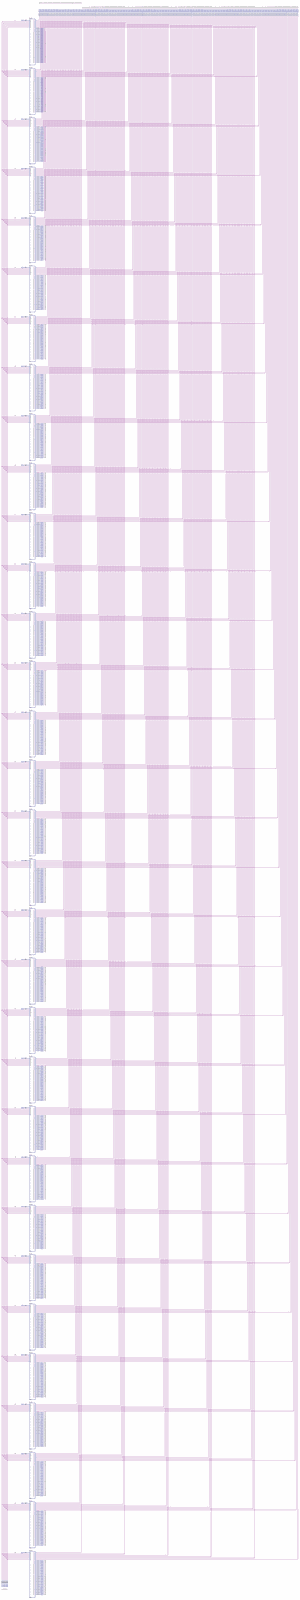
[diagram p0: schematic sheet, whole]
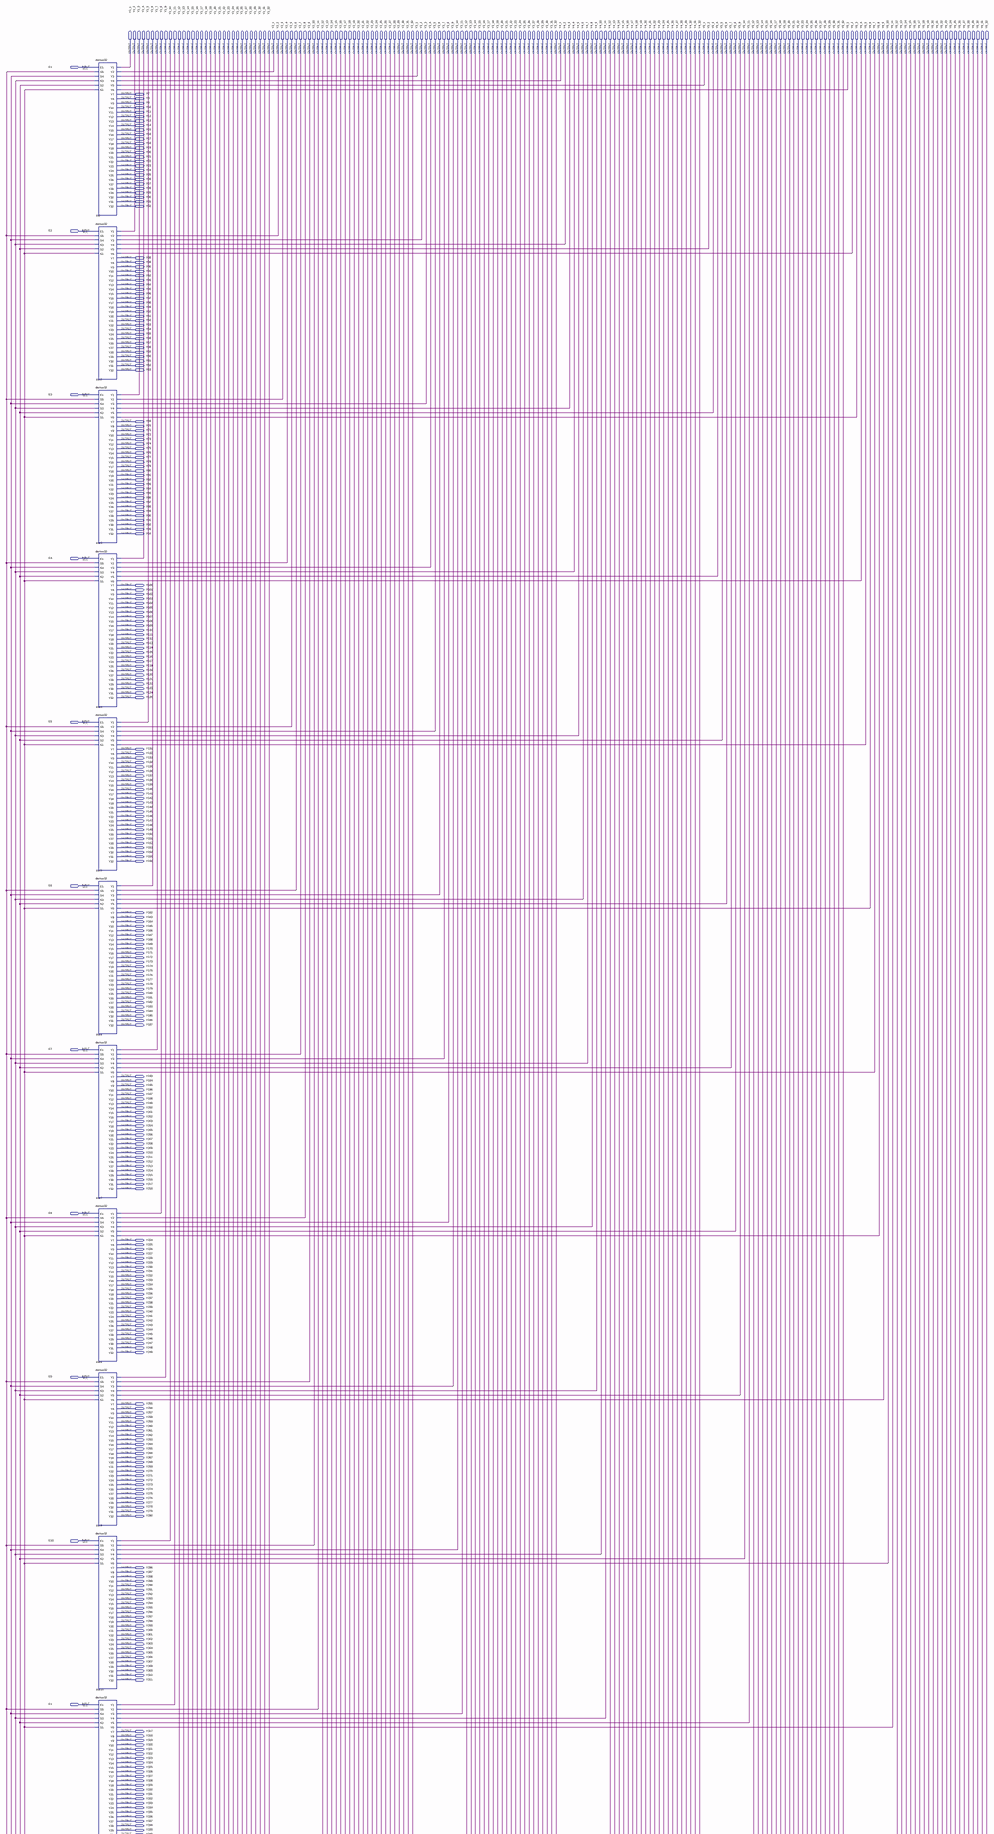
[diagram p1: schematic sheet, upper part]
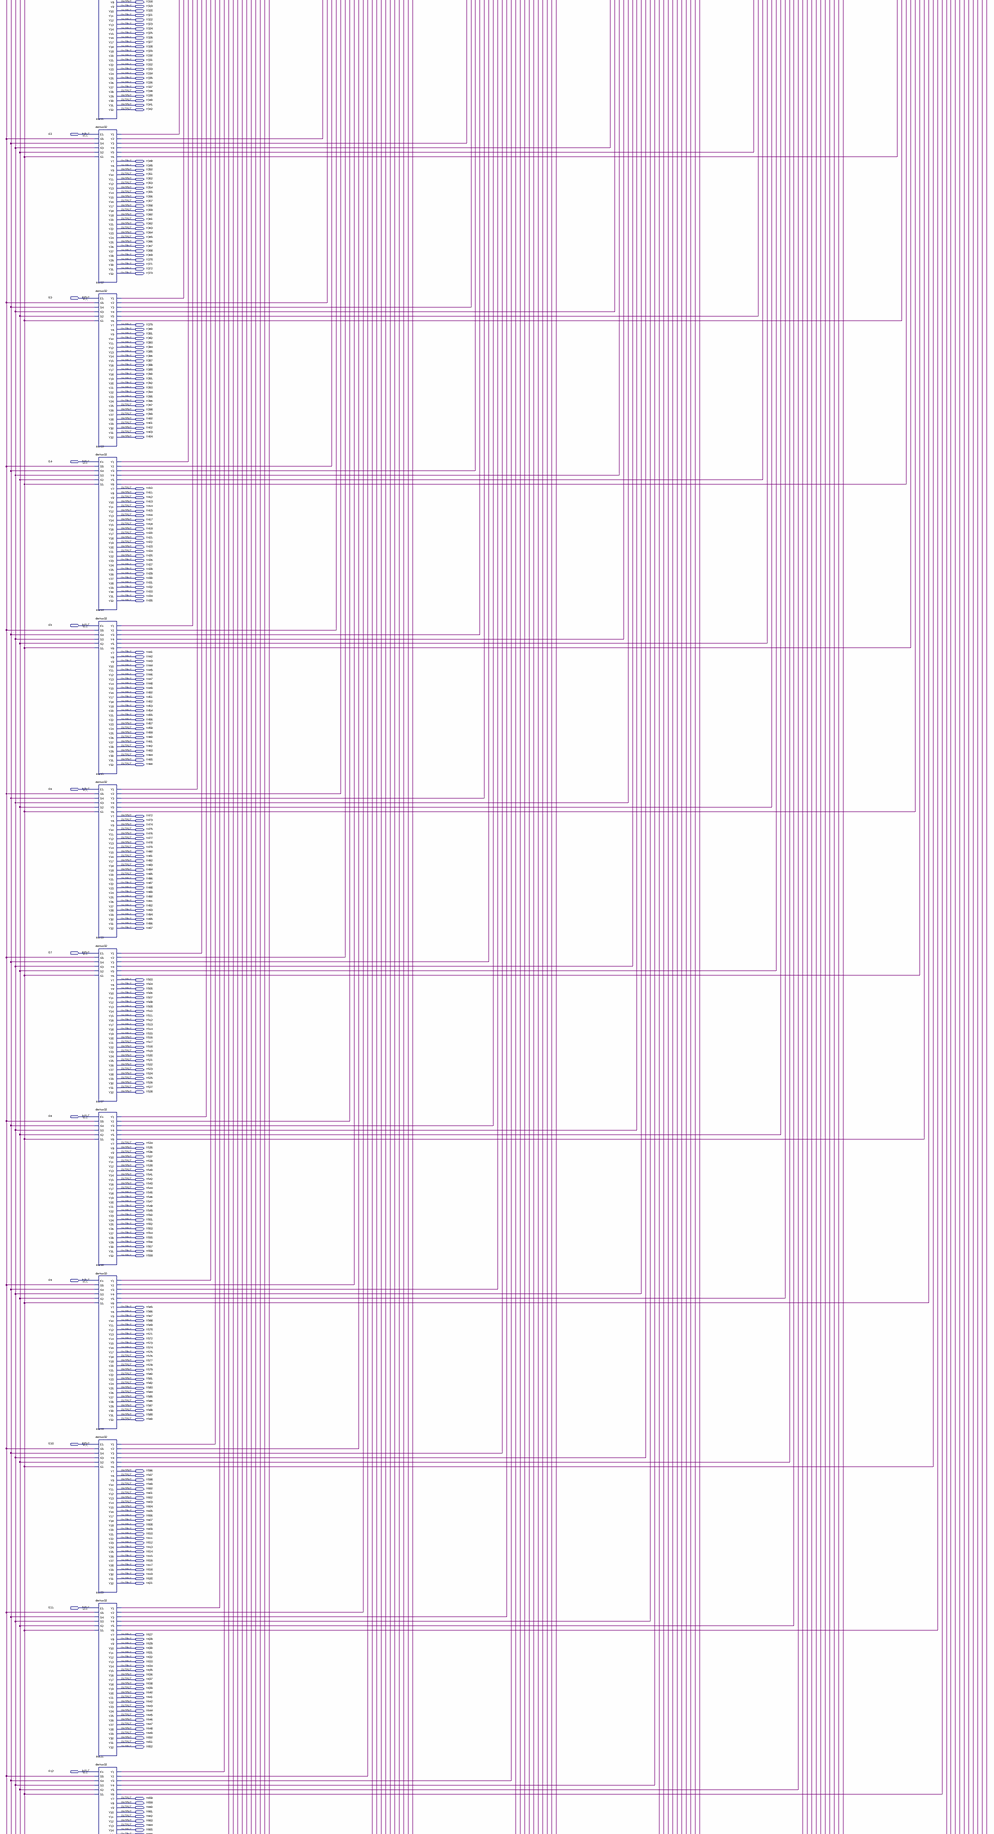
[diagram p2: schematic sheet, middle part]
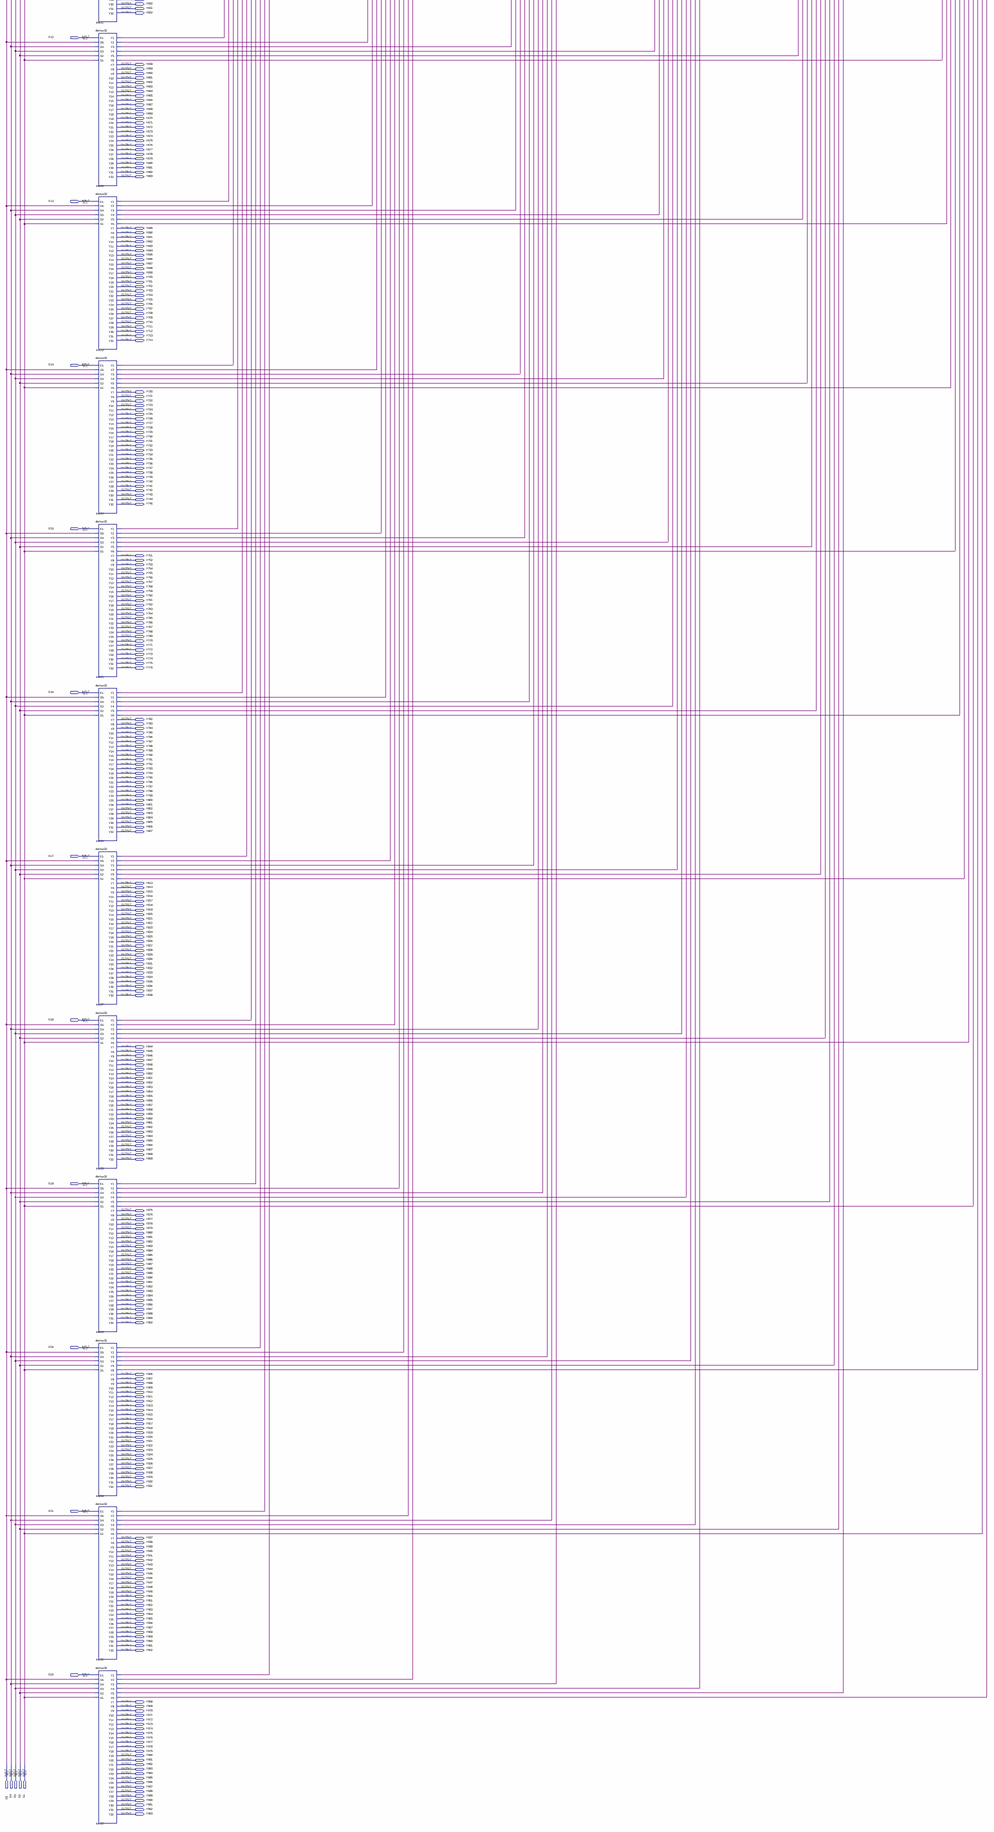
[diagram p3: schematic sheet, lower part]
// Quartus schematic demux32x32.bdf as structural Verilog: 32 symbols, 1061 pins
module demux32x32 (
  input  E1,
  input  E2,
  input  E3,
  input  E4,
  input  E5,
  input  E6,
  input  E7,
  input  E8,
  input  E9,
  input  E10,
  input  E11,
  input  E12,
  input  E13,
  input  E14,
  input  E15,
  input  E16,
  input  E17,
  input  E18,
  input  E19,
  input  E20,
  input  E21,
  input  E22,
  input  S5,
  input  S4,
  input  S3,
  input  S2,
  input  S1,
  output Y1_1,
  output Y1_2,
  output Y1_3,
  output Y1_4,
  output Y1_5,
  output Y1_6,
  output Y1_7,
  output Y1_8,
  output Y1_9,
  output Y1_10,
  output Y1_11,
  output Y1_12,
  output Y1_13,
  output Y1_14,
  output Y1_15,
  output Y1_16,
  output Y1_17,
  output Y1_18,
  output Y1_19,
  output Y1_20,
  output Y1_21,
  output Y1_22,
  output Y1_23,
  output Y1_24,
  output Y1_25,
  output Y1_26,
  output Y1_27,
  output Y1_28,
  output Y1_29,
  output Y1_30,
  output Y1_31,
  output Y1_32,
  output Y2_1,
  output Y2_2,
  output Y2_3,
  output Y2_4,
  output Y2_5,
  output Y2_6,
  output Y2_7,
  output Y2_8,
  output Y2_9,
  output Y2_10,
  output Y2_11,
  output Y2_12,
  output Y2_13,
  output Y2_14,
  output Y2_15,
  output Y2_16,
  output Y2_17,
  output Y2_18,
  output Y2_19,
  output Y2_20,
  output Y2_21,
  output Y2_22,
  output Y2_23,
  output Y2_24,
  output Y2_25,
  output Y2_26,
  output Y2_27,
  output Y2_28,
  output Y2_29,
  output Y2_30,
  output Y2_31,
  output Y2_32,
  output Y3_1,
  output Y3_2,
  output Y3_3,
  output Y3_4,
  output Y3_5,
  output Y3_6,
  output Y3_7,
  output Y3_8,
  output Y3_9,
  output Y3_10,
  output Y3_11,
  output Y3_12,
  output Y3_13,
  output Y3_14,
  output Y3_15,
  output Y3_16,
  output Y3_17,
  output Y3_18,
  output Y3_19,
  output Y3_20,
  output Y3_21,
  output Y3_22,
  output Y3_23,
  output Y3_24,
  output Y3_25,
  output Y3_26,
  output Y3_27,
  output Y3_28,
  output Y3_29,
  output Y3_30,
  output Y3_31,
  output Y3_32,
  output Y4_1,
  output Y4_2,
  output Y4_3,
  output Y4_4,
  output Y4_5,
  output Y4_6,
  output Y4_7,
  output Y4_8,
  output Y4_9,
  output Y4_10,
  output Y4_11,
  output Y4_12,
  output Y4_13,
  output Y4_14,
  output Y4_15,
  output Y4_16,
  output Y4_17,
  output Y4_18,
  output Y4_19,
  output Y4_20,
  output Y4_21,
  output Y4_22,
  output Y4_23,
  output Y4_24,
  output Y4_25,
  output Y4_26,
  output Y4_27,
  output Y4_28,
  output Y4_29,
  output Y4_30,
  output Y4_31,
  output Y4_32,
  output Y5_1,
  output Y5_2,
  output Y5_3,
  output Y5_4,
  output Y5_5,
  output Y5_6,
  output Y5_7,
  output Y5_8,
  output Y5_9,
  output Y5_10,
  output Y5_11,
  output Y5_12,
  output Y5_13,
  output Y5_14,
  output Y5_15,
  output Y5_16,
  output Y5_17,
  output Y5_18,
  output Y5_19,
  output Y5_20,
  output Y5_21,
  output Y5_22,
  output Y5_23,
  output Y5_24,
  output Y5_25,
  output Y5_26,
  output Y5_27,
  output Y5_28,
  output Y5_29,
  output Y5_30,
  output Y5_31,
  output Y5_32,
  output Y6_1,
  output Y6_2,
  output Y6_3,
  output Y6_4,
  output Y6_5,
  output Y6_6,
  output Y6_7,
  output Y6_8,
  output Y6_9,
  output Y6_10,
  output Y6_11,
  output Y6_12,
  output Y6_13,
  output Y6_14,
  output Y6_15,
  output Y6_16,
  output Y6_17,
  output Y6_18,
  output Y6_19,
  output Y6_20,
  output Y6_21,
  output Y6_22,
  output Y6_23,
  output Y6_24,
  output Y6_25,
  output Y6_26,
  output Y6_27,
  output Y6_28,
  output Y6_29,
  output Y6_30,
  output Y6_31,
  output Y6_32,
  output Y7,
  output Y8,
  output Y9,
  output Y10,
  output Y11,
  output Y12,
  output Y13,
  output Y14,
  output Y15,
  output Y16,
  output Y17,
  output Y18,
  output Y19,
  output Y20,
  output Y21,
  output Y22,
  output Y23,
  output Y24,
  output Y25,
  output Y26,
  output Y27,
  output Y28,
  output Y29,
  output Y30,
  output Y31,
  output Y32,
  output Y38,
  output Y39,
  output Y40,
  output Y41,
  output Y42,
  output Y43,
  output Y44,
  output Y45,
  output Y46,
  output Y47,
  output Y48,
  output Y49,
  output Y50,
  output Y51,
  output Y52,
  output Y53,
  output Y54,
  output Y55,
  output Y56,
  output Y57,
  output Y58,
  output Y59,
  output Y60,
  output Y61,
  output Y62,
  output Y63,
  output Y69,
  output Y70,
  output Y71,
  output Y72,
  output Y73,
  output Y74,
  output Y75,
  output Y76,
  output Y77,
  output Y78,
  output Y79,
  output Y80,
  output Y81,
  output Y82,
  output Y83,
  output Y84,
  output Y85,
  output Y86,
  output Y87,
  output Y88,
  output Y89,
  output Y90,
  output Y91,
  output Y92,
  output Y93,
  output Y94,
  output Y100,
  output Y101,
  output Y102,
  output Y103,
  output Y104,
  output Y105,
  output Y106,
  output Y107,
  output Y108,
  output Y109,
  output Y110,
  output Y111,
  output Y112,
  output Y113,
  output Y114,
  output Y115,
  output Y116,
  output Y117,
  output Y118,
  output Y119,
  output Y120,
  output Y121,
  output Y122,
  output Y123,
  output Y124,
  output Y125,
  output Y131,
  output Y132,
  output Y133,
  output Y134,
  output Y135,
  output Y136,
  output Y137,
  output Y138,
  output Y139,
  output Y140,
  output Y141,
  output Y142,
  output Y143,
  output Y144,
  output Y145,
  output Y146,
  output Y147,
  output Y148,
  output Y149,
  output Y150,
  output Y151,
  output Y152,
  output Y153,
  output Y154,
  output Y155,
  output Y156,
  output Y162,
  output Y163,
  output Y164,
  output Y165,
  output Y166,
  output Y167,
  output Y168,
  output Y169,
  output Y170,
  output Y171,
  output Y172,
  output Y173,
  output Y174,
  output Y175,
  output Y176,
  output Y177,
  output Y178,
  output Y179,
  output Y180,
  output Y181,
  output Y182,
  output Y183,
  output Y184,
  output Y185,
  output Y186,
  output Y187,
  output Y193,
  output Y194,
  output Y195,
  output Y196,
  output Y197,
  output Y198,
  output Y199,
  output Y200,
  output Y201,
  output Y202,
  output Y203,
  output Y204,
  output Y205,
  output Y206,
  output Y207,
  output Y208,
  output Y209,
  output Y210,
  output Y211,
  output Y212,
  output Y213,
  output Y214,
  output Y215,
  output Y216,
  output Y217,
  output Y218,
  output Y224,
  output Y225,
  output Y226,
  output Y227,
  output Y228,
  output Y229,
  output Y230,
  output Y231,
  output Y232,
  output Y233,
  output Y234,
  output Y235,
  output Y236,
  output Y237,
  output Y238,
  output Y239,
  output Y240,
  output Y241,
  output Y242,
  output Y243,
  output Y244,
  output Y245,
  output Y246,
  output Y247,
  output Y248,
  output Y249,
  output Y255,
  output Y256,
  output Y257,
  output Y258,
  output Y259,
  output Y260,
  output Y261,
  output Y262,
  output Y263,
  output Y264,
  output Y265,
  output Y266,
  output Y267,
  output Y268,
  output Y269,
  output Y270,
  output Y271,
  output Y272,
  output Y273,
  output Y274,
  output Y275,
  output Y276,
  output Y277,
  output Y278,
  output Y279,
  output Y280,
  output Y286,
  output Y287,
  output Y288,
  output Y289,
  output Y290,
  output Y291,
  output Y292,
  output Y293,
  output Y294,
  output Y295,
  output Y296,
  output Y297,
  output Y298,
  output Y299,
  output Y300,
  output Y301,
  output Y302,
  output Y303,
  output Y304,
  output Y305,
  output Y306,
  output Y307,
  output Y308,
  output Y309,
  output Y310,
  output Y311,
  output Y317,
  output Y318,
  output Y319,
  output Y320,
  output Y321,
  output Y322,
  output Y323,
  output Y324,
  output Y325,
  output Y326,
  output Y327,
  output Y328,
  output Y329,
  output Y330,
  output Y331,
  output Y332,
  output Y333,
  output Y334,
  output Y335,
  output Y336,
  output Y337,
  output Y338,
  output Y339,
  output Y340,
  output Y341,
  output Y342,
  output Y348,
  output Y349,
  output Y350,
  output Y351,
  output Y352,
  output Y353,
  output Y354,
  output Y355,
  output Y356,
  output Y357,
  output Y358,
  output Y359,
  output Y360,
  output Y361,
  output Y362,
  output Y363,
  output Y364,
  output Y365,
  output Y366,
  output Y367,
  output Y368,
  output Y369,
  output Y370,
  output Y371,
  output Y372,
  output Y373,
  output Y379,
  output Y380,
  output Y381,
  output Y382,
  output Y383,
  output Y384,
  output Y385,
  output Y386,
  output Y387,
  output Y388,
  output Y389,
  output Y390,
  output Y391,
  output Y392,
  output Y393,
  output Y394,
  output Y395,
  output Y396,
  output Y397,
  output Y398,
  output Y399,
  output Y400,
  output Y401,
  output Y402,
  output Y403,
  output Y404,
  output Y410,
  output Y411,
  output Y412,
  output Y413,
  output Y414,
  output Y415,
  output Y416,
  output Y417,
  output Y418,
  output Y419,
  output Y420,
  output Y421,
  output Y422,
  output Y423,
  output Y424,
  output Y425,
  output Y426,
  output Y427,
  output Y428,
  output Y429,
  output Y430,
  output Y431,
  output Y432,
  output Y433,
  output Y434,
  output Y435,
  output Y441,
  output Y442,
  output Y443,
  output Y444,
  output Y445,
  output Y446,
  output Y447,
  output Y448,
  output Y449,
  output Y450,
  output Y451,
  output Y452,
  output Y453,
  output Y454,
  output Y455,
  output Y456,
  output Y457,
  output Y458,
  output Y459,
  output Y460,
  output Y461,
  output Y462,
  output Y463,
  output Y464,
  output Y465,
  output Y466,
  output Y472,
  output Y473,
  output Y474,
  output Y475,
  output Y476,
  output Y477,
  output Y478,
  output Y479,
  output Y480,
  output Y481,
  output Y482,
  output Y483,
  output Y484,
  output Y485,
  output Y486,
  output Y487,
  output Y488,
  output Y489,
  output Y490,
  output Y491,
  output Y492,
  output Y493,
  output Y494,
  output Y495,
  output Y496,
  output Y497,
  output Y503,
  output Y504,
  output Y505,
  output Y506,
  output Y507,
  output Y508,
  output Y509,
  output Y510,
  output Y511,
  output Y512,
  output Y513,
  output Y514,
  output Y515,
  output Y516,
  output Y517,
  output Y518,
  output Y519,
  output Y520,
  output Y521,
  output Y522,
  output Y523,
  output Y524,
  output Y525,
  output Y526,
  output Y527,
  output Y528,
  output Y534,
  output Y535,
  output Y536,
  output Y537,
  output Y538,
  output Y539,
  output Y540,
  output Y541,
  output Y542,
  output Y543,
  output Y544,
  output Y545,
  output Y546,
  output Y547,
  output Y548,
  output Y549,
  output Y550,
  output Y551,
  output Y552,
  output Y553,
  output Y554,
  output Y555,
  output Y556,
  output Y557,
  output Y558,
  output Y559,
  output Y565,
  output Y566,
  output Y567,
  output Y568,
  output Y569,
  output Y570,
  output Y571,
  output Y572,
  output Y573,
  output Y574,
  output Y575,
  output Y576,
  output Y577,
  output Y578,
  output Y579,
  output Y580,
  output Y581,
  output Y582,
  output Y583,
  output Y584,
  output Y585,
  output Y586,
  output Y587,
  output Y588,
  output Y589,
  output Y590,
  output Y596,
  output Y597,
  output Y598,
  output Y599,
  output Y600,
  output Y601,
  output Y602,
  output Y603,
  output Y604,
  output Y605,
  output Y606,
  output Y607,
  output Y608,
  output Y609,
  output Y610,
  output Y611,
  output Y612,
  output Y613,
  output Y614,
  output Y615,
  output Y616,
  output Y617,
  output Y618,
  output Y619,
  output Y620,
  output Y621,
  output Y627,
  output Y628,
  output Y629,
  output Y630,
  output Y631,
  output Y632,
  output Y633,
  output Y634,
  output Y635,
  output Y636,
  output Y637,
  output Y638,
  output Y639,
  output Y640,
  output Y641,
  output Y642,
  output Y643,
  output Y644,
  output Y645,
  output Y646,
  output Y647,
  output Y648,
  output Y649,
  output Y650,
  output Y651,
  output Y652,
  output Y658,
  output Y659,
  output Y660,
  output Y661,
  output Y662,
  output Y663,
  output Y664,
  output Y665,
  output Y666,
  output Y667,
  output Y668,
  output Y669,
  output Y670,
  output Y671,
  output Y672,
  output Y673,
  output Y674,
  output Y675,
  output Y676,
  output Y677,
  output Y678,
  output Y679,
  output Y680,
  output Y681,
  output Y682,
  output Y683,
  output Y689,
  output Y690,
  output Y691,
  output Y692,
  output Y693,
  output Y694,
  output Y695,
  output Y696,
  output Y697,
  output Y698,
  output Y699,
  output Y700,
  output Y701,
  output Y702,
  output Y703,
  output Y704,
  output Y705,
  output Y706,
  output Y707,
  output Y708,
  output Y709,
  output Y710,
  output Y711,
  output Y712,
  output Y713,
  output Y714,
  output Y720,
  output Y721,
  output Y722,
  output Y723,
  output Y724,
  output Y725,
  output Y726,
  output Y727,
  output Y728,
  output Y729,
  output Y730,
  output Y731,
  output Y732,
  output Y733,
  output Y734,
  output Y735,
  output Y736,
  output Y737,
  output Y738,
  output Y739,
  output Y740,
  output Y741,
  output Y742,
  output Y743,
  output Y744,
  output Y745,
  output Y751,
  output Y752,
  output Y753,
  output Y754,
  output Y755,
  output Y756,
  output Y757,
  output Y758,
  output Y759,
  output Y760,
  output Y761,
  output Y762,
  output Y763,
  output Y764,
  output Y765,
  output Y766,
  output Y767,
  output Y768,
  output Y769,
  output Y770,
  output Y771,
  output Y772,
  output Y773,
  output Y774,
  output Y775,
  output Y776,
  output Y782,
  output Y783,
  output Y784,
  output Y785,
  output Y786,
  output Y787,
  output Y788,
  output Y789,
  output Y790,
  output Y791,
  output Y792,
  output Y793,
  output Y794,
  output Y795,
  output Y796,
  output Y797,
  output Y798,
  output Y799,
  output Y800,
  output Y801,
  output Y802,
  output Y803,
  output Y804,
  output Y805,
  output Y806,
  output Y807,
  output Y813,
  output Y814,
  output Y815,
  output Y816,
  output Y817,
  output Y818,
  output Y819,
  output Y820,
  output Y821,
  output Y822,
  output Y823,
  output Y824,
  output Y825,
  output Y826,
  output Y827,
  output Y828,
  output Y829,
  output Y830,
  output Y831,
  output Y832,
  output Y833,
  output Y834,
  output Y835,
  output Y836,
  output Y837,
  output Y838,
  output Y844,
  output Y845,
  output Y846,
  output Y847,
  output Y848,
  output Y849,
  output Y850,
  output Y851,
  output Y852,
  output Y853,
  output Y854,
  output Y855,
  output Y856,
  output Y857,
  output Y858,
  output Y859,
  output Y860,
  output Y861,
  output Y862,
  output Y863,
  output Y864,
  output Y865,
  output Y866,
  output Y867,
  output Y868,
  output Y869,
  output Y875,
  output Y876,
  output Y877,
  output Y878,
  output Y879,
  output Y880,
  output Y881,
  output Y882,
  output Y883,
  output Y884,
  output Y885,
  output Y886,
  output Y887,
  output Y888,
  output Y889,
  output Y890,
  output Y891,
  output Y892,
  output Y893,
  output Y894,
  output Y895,
  output Y896,
  output Y897,
  output Y898,
  output Y899,
  output Y900,
  output Y906,
  output Y907,
  output Y908,
  output Y909,
  output Y910,
  output Y911,
  output Y912,
  output Y913,
  output Y914,
  output Y915,
  output Y916,
  output Y917,
  output Y918,
  output Y919,
  output Y920,
  output Y921,
  output Y922,
  output Y923,
  output Y924,
  output Y925,
  output Y926,
  output Y927,
  output Y928,
  output Y929,
  output Y930,
  output Y931,
  output Y937,
  output Y938,
  output Y939,
  output Y940,
  output Y941,
  output Y942,
  output Y943,
  output Y944,
  output Y945,
  output Y946,
  output Y947,
  output Y948,
  output Y949,
  output Y950,
  output Y951,
  output Y952,
  output Y953,
  output Y954,
  output Y955,
  output Y956,
  output Y957,
  output Y958,
  output Y959,
  output Y960,
  output Y961,
  output Y962,
  output Y968,
  output Y969,
  output Y970,
  output Y971,
  output Y972,
  output Y973,
  output Y974,
  output Y975,
  output Y976,
  output Y977,
  output Y978,
  output Y979,
  output Y980,
  output Y981,
  output Y982,
  output Y983,
  output Y984,
  output Y985,
  output Y986,
  output Y987,
  output Y988,
  output Y989,
  output Y990,
  output Y991,
  output Y992,
  output Y993
);

  demux32 inst (
    .E1(E1), .S5(S5), .S4(S4), .S3(S3), .S2(S2), .S1(S1), .Y1(Y1_1), .Y2(Y2_1), .Y3(Y3_1), .Y4(Y4_1),
    .Y5(Y5_1), .Y6(Y6_1), .Y7(Y7), .Y8(Y8), .Y9(Y9), .Y10(Y10), .Y11(Y11), .Y12(Y12), .Y13(Y13), .Y14(Y14),
    .Y15(Y15), .Y16(Y16), .Y17(Y17), .Y18(Y18), .Y19(Y19), .Y20(Y20), .Y21(Y21), .Y22(Y22), .Y23(Y23),
    .Y24(Y24), .Y25(Y25), .Y26(Y26), .Y27(Y27), .Y28(Y28), .Y29(Y29), .Y30(Y30), .Y31(Y31), .Y32(Y32));
  demux32 inst2 (
    .E1(E2), .S5(S5), .S4(S4), .S3(S3), .S2(S2), .S1(S1), .Y1(Y1_2), .Y2(Y2_2), .Y3(Y3_2), .Y4(Y4_2),
    .Y5(Y5_2), .Y6(Y6_2), .Y7(Y38), .Y8(Y39), .Y9(Y40), .Y10(Y41), .Y11(Y42), .Y12(Y43), .Y13(Y44),
    .Y14(Y45), .Y15(Y46), .Y16(Y47), .Y17(Y48), .Y18(Y49), .Y19(Y50), .Y20(Y51), .Y21(Y52), .Y22(Y53),
    .Y23(Y54), .Y24(Y55), .Y25(Y56), .Y26(Y57), .Y27(Y58), .Y28(Y59), .Y29(Y60), .Y30(Y61), .Y31(Y62),
    .Y32(Y63));
  demux32 inst3 (
    .E1(E3), .S5(S5), .S4(S4), .S3(S3), .S2(S2), .S1(S1), .Y1(Y1_3), .Y2(Y2_3), .Y3(Y3_3), .Y4(Y4_3),
    .Y5(Y5_3), .Y6(Y6_3), .Y7(Y69), .Y8(Y70), .Y9(Y71), .Y10(Y72), .Y11(Y73), .Y12(Y74), .Y13(Y75),
    .Y14(Y76), .Y15(Y77), .Y16(Y78), .Y17(Y79), .Y18(Y80), .Y19(Y81), .Y20(Y82), .Y21(Y83), .Y22(Y84),
    .Y23(Y85), .Y24(Y86), .Y25(Y87), .Y26(Y88), .Y27(Y89), .Y28(Y90), .Y29(Y91), .Y30(Y92), .Y31(Y93),
    .Y32(Y94));
  demux32 inst4 (
    .E1(E4), .S5(S5), .S4(S4), .S3(S3), .S2(S2), .S1(S1), .Y1(Y1_4), .Y2(Y2_4), .Y3(Y3_4), .Y4(Y4_4),
    .Y5(Y5_4), .Y6(Y6_4), .Y7(Y100), .Y8(Y101), .Y9(Y102), .Y10(Y103), .Y11(Y104), .Y12(Y105), .Y13(Y106),
    .Y14(Y107), .Y15(Y108), .Y16(Y109), .Y17(Y110), .Y18(Y111), .Y19(Y112), .Y20(Y113), .Y21(Y114),
    .Y22(Y115), .Y23(Y116), .Y24(Y117), .Y25(Y118), .Y26(Y119), .Y27(Y120), .Y28(Y121), .Y29(Y122),
    .Y30(Y123), .Y31(Y124), .Y32(Y125));
  demux32 inst5 (
    .E1(E5), .S5(S5), .S4(S4), .S3(S3), .S2(S2), .S1(S1), .Y1(Y1_5), .Y2(Y2_5), .Y3(Y3_5), .Y4(Y4_5),
    .Y5(Y5_5), .Y6(Y6_5), .Y7(Y131), .Y8(Y132), .Y9(Y133), .Y10(Y134), .Y11(Y135), .Y12(Y136), .Y13(Y137),
    .Y14(Y138), .Y15(Y139), .Y16(Y140), .Y17(Y141), .Y18(Y142), .Y19(Y143), .Y20(Y144), .Y21(Y145),
    .Y22(Y146), .Y23(Y147), .Y24(Y148), .Y25(Y149), .Y26(Y150), .Y27(Y151), .Y28(Y152), .Y29(Y153),
    .Y30(Y154), .Y31(Y155), .Y32(Y156));
  demux32 inst6 (
    .E1(E6), .S5(S5), .S4(S4), .S3(S3), .S2(S2), .S1(S1), .Y1(Y1_6), .Y2(Y2_6), .Y3(Y3_6), .Y4(Y4_6),
    .Y5(Y5_6), .Y6(Y6_6), .Y7(Y162), .Y8(Y163), .Y9(Y164), .Y10(Y165), .Y11(Y166), .Y12(Y167), .Y13(Y168),
    .Y14(Y169), .Y15(Y170), .Y16(Y171), .Y17(Y172), .Y18(Y173), .Y19(Y174), .Y20(Y175), .Y21(Y176),
    .Y22(Y177), .Y23(Y178), .Y24(Y179), .Y25(Y180), .Y26(Y181), .Y27(Y182), .Y28(Y183), .Y29(Y184),
    .Y30(Y185), .Y31(Y186), .Y32(Y187));
  demux32 inst7 (
    .E1(E7), .S5(S5), .S4(S4), .S3(S3), .S2(S2), .S1(S1), .Y1(Y1_7), .Y2(Y2_7), .Y3(Y3_7), .Y4(Y4_7),
    .Y5(Y5_7), .Y6(Y6_7), .Y7(Y193), .Y8(Y194), .Y9(Y195), .Y10(Y196), .Y11(Y197), .Y12(Y198), .Y13(Y199),
    .Y14(Y200), .Y15(Y201), .Y16(Y202), .Y17(Y203), .Y18(Y204), .Y19(Y205), .Y20(Y206), .Y21(Y207),
    .Y22(Y208), .Y23(Y209), .Y24(Y210), .Y25(Y211), .Y26(Y212), .Y27(Y213), .Y28(Y214), .Y29(Y215),
    .Y30(Y216), .Y31(Y217), .Y32(Y218));
  demux32 inst8 (
    .E1(E8), .S5(S5), .S4(S4), .S3(S3), .S2(S2), .S1(S1), .Y1(Y1_8), .Y2(Y2_8), .Y3(Y3_8), .Y4(Y4_8),
    .Y5(Y5_8), .Y6(Y6_8), .Y7(Y224), .Y8(Y225), .Y9(Y226), .Y10(Y227), .Y11(Y228), .Y12(Y229), .Y13(Y230),
    .Y14(Y231), .Y15(Y232), .Y16(Y233), .Y17(Y234), .Y18(Y235), .Y19(Y236), .Y20(Y237), .Y21(Y238),
    .Y22(Y239), .Y23(Y240), .Y24(Y241), .Y25(Y242), .Y26(Y243), .Y27(Y244), .Y28(Y245), .Y29(Y246),
    .Y30(Y247), .Y31(Y248), .Y32(Y249));
  demux32 inst9 (
    .E1(E9), .S5(S5), .S4(S4), .S3(S3), .S2(S2), .S1(S1), .Y1(Y1_9), .Y2(Y2_9), .Y3(Y3_9), .Y4(Y4_9),
    .Y5(Y5_9), .Y6(Y6_9), .Y7(Y255), .Y8(Y256), .Y9(Y257), .Y10(Y258), .Y11(Y259), .Y12(Y260), .Y13(Y261),
    .Y14(Y262), .Y15(Y263), .Y16(Y264), .Y17(Y265), .Y18(Y266), .Y19(Y267), .Y20(Y268), .Y21(Y269),
    .Y22(Y270), .Y23(Y271), .Y24(Y272), .Y25(Y273), .Y26(Y274), .Y27(Y275), .Y28(Y276), .Y29(Y277),
    .Y30(Y278), .Y31(Y279), .Y32(Y280));
  demux32 inst10 (
    .E1(E10), .S5(S5), .S4(S4), .S3(S3), .S2(S2), .S1(S1), .Y1(Y1_10), .Y2(Y2_10), .Y3(Y3_10), .Y4(Y4_10),
    .Y5(Y5_10), .Y6(Y6_10), .Y7(Y286), .Y8(Y287), .Y9(Y288), .Y10(Y289), .Y11(Y290), .Y12(Y291), .Y13(Y292),
    .Y14(Y293), .Y15(Y294), .Y16(Y295), .Y17(Y296), .Y18(Y297), .Y19(Y298), .Y20(Y299), .Y21(Y300),
    .Y22(Y301), .Y23(Y302), .Y24(Y303), .Y25(Y304), .Y26(Y305), .Y27(Y306), .Y28(Y307), .Y29(Y308),
    .Y30(Y309), .Y31(Y310), .Y32(Y311));
  demux32 inst11 (
    .E1(E1), .S5(S5), .S4(S4), .S3(S3), .S2(S2), .S1(S1), .Y1(Y1_11), .Y2(Y2_11), .Y3(Y3_11), .Y4(Y4_11),
    .Y5(Y5_11), .Y6(Y6_11), .Y7(Y317), .Y8(Y318), .Y9(Y319), .Y10(Y320), .Y11(Y321), .Y12(Y322), .Y13(Y323),
    .Y14(Y324), .Y15(Y325), .Y16(Y326), .Y17(Y327), .Y18(Y328), .Y19(Y329), .Y20(Y330), .Y21(Y331),
    .Y22(Y332), .Y23(Y333), .Y24(Y334), .Y25(Y335), .Y26(Y336), .Y27(Y337), .Y28(Y338), .Y29(Y339),
    .Y30(Y340), .Y31(Y341), .Y32(Y342));
  demux32 inst12 (
    .E1(E2), .S5(S5), .S4(S4), .S3(S3), .S2(S2), .S1(S1), .Y1(Y1_12), .Y2(Y2_12), .Y3(Y3_12), .Y4(Y4_12),
    .Y5(Y5_12), .Y6(Y6_12), .Y7(Y348), .Y8(Y349), .Y9(Y350), .Y10(Y351), .Y11(Y352), .Y12(Y353), .Y13(Y354),
    .Y14(Y355), .Y15(Y356), .Y16(Y357), .Y17(Y358), .Y18(Y359), .Y19(Y360), .Y20(Y361), .Y21(Y362),
    .Y22(Y363), .Y23(Y364), .Y24(Y365), .Y25(Y366), .Y26(Y367), .Y27(Y368), .Y28(Y369), .Y29(Y370),
    .Y30(Y371), .Y31(Y372), .Y32(Y373));
  demux32 inst13 (
    .E1(E3), .S5(S5), .S4(S4), .S3(S3), .S2(S2), .S1(S1), .Y1(Y1_13), .Y2(Y2_13), .Y3(Y3_13), .Y4(Y4_13),
    .Y5(Y5_13), .Y6(Y6_13), .Y7(Y379), .Y8(Y380), .Y9(Y381), .Y10(Y382), .Y11(Y383), .Y12(Y384), .Y13(Y385),
    .Y14(Y386), .Y15(Y387), .Y16(Y388), .Y17(Y389), .Y18(Y390), .Y19(Y391), .Y20(Y392), .Y21(Y393),
    .Y22(Y394), .Y23(Y395), .Y24(Y396), .Y25(Y397), .Y26(Y398), .Y27(Y399), .Y28(Y400), .Y29(Y401),
    .Y30(Y402), .Y31(Y403), .Y32(Y404));
  demux32 inst14 (
    .E1(E4), .S5(S5), .S4(S4), .S3(S3), .S2(S2), .S1(S1), .Y1(Y1_14), .Y2(Y2_14), .Y3(Y3_14), .Y4(Y4_14),
    .Y5(Y5_14), .Y6(Y6_14), .Y7(Y410), .Y8(Y411), .Y9(Y412), .Y10(Y413), .Y11(Y414), .Y12(Y415), .Y13(Y416),
    .Y14(Y417), .Y15(Y418), .Y16(Y419), .Y17(Y420), .Y18(Y421), .Y19(Y422), .Y20(Y423), .Y21(Y424),
    .Y22(Y425), .Y23(Y426), .Y24(Y427), .Y25(Y428), .Y26(Y429), .Y27(Y430), .Y28(Y431), .Y29(Y432),
    .Y30(Y433), .Y31(Y434), .Y32(Y435));
  demux32 inst15 (
    .E1(E5), .S5(S5), .S4(S4), .S3(S3), .S2(S2), .S1(S1), .Y1(Y1_15), .Y2(Y2_15), .Y3(Y3_15), .Y4(Y4_15),
    .Y5(Y5_15), .Y6(Y6_15), .Y7(Y441), .Y8(Y442), .Y9(Y443), .Y10(Y444), .Y11(Y445), .Y12(Y446), .Y13(Y447),
    .Y14(Y448), .Y15(Y449), .Y16(Y450), .Y17(Y451), .Y18(Y452), .Y19(Y453), .Y20(Y454), .Y21(Y455),
    .Y22(Y456), .Y23(Y457), .Y24(Y458), .Y25(Y459), .Y26(Y460), .Y27(Y461), .Y28(Y462), .Y29(Y463),
    .Y30(Y464), .Y31(Y465), .Y32(Y466));
  demux32 inst16 (
    .E1(E6), .S5(S5), .S4(S4), .S3(S3), .S2(S2), .S1(S1), .Y1(Y1_16), .Y2(Y2_16), .Y3(Y3_16), .Y4(Y4_16),
    .Y5(Y5_16), .Y6(Y6_16), .Y7(Y472), .Y8(Y473), .Y9(Y474), .Y10(Y475), .Y11(Y476), .Y12(Y477), .Y13(Y478),
    .Y14(Y479), .Y15(Y480), .Y16(Y481), .Y17(Y482), .Y18(Y483), .Y19(Y484), .Y20(Y485), .Y21(Y486),
    .Y22(Y487), .Y23(Y488), .Y24(Y489), .Y25(Y490), .Y26(Y491), .Y27(Y492), .Y28(Y493), .Y29(Y494),
    .Y30(Y495), .Y31(Y496), .Y32(Y497));
  demux32 inst17 (
    .E1(E7), .S5(S5), .S4(S4), .S3(S3), .S2(S2), .S1(S1), .Y1(Y1_17), .Y2(Y2_17), .Y3(Y3_17), .Y4(Y4_17),
    .Y5(Y5_17), .Y6(Y6_17), .Y7(Y503), .Y8(Y504), .Y9(Y505), .Y10(Y506), .Y11(Y507), .Y12(Y508), .Y13(Y509),
    .Y14(Y510), .Y15(Y511), .Y16(Y512), .Y17(Y513), .Y18(Y514), .Y19(Y515), .Y20(Y516), .Y21(Y517),
    .Y22(Y518), .Y23(Y519), .Y24(Y520), .Y25(Y521), .Y26(Y522), .Y27(Y523), .Y28(Y524), .Y29(Y525),
    .Y30(Y526), .Y31(Y527), .Y32(Y528));
  demux32 inst18 (
    .E1(E8), .S5(S5), .S4(S4), .S3(S3), .S2(S2), .S1(S1), .Y1(Y1_18), .Y2(Y2_18), .Y3(Y3_18), .Y4(Y4_18),
    .Y5(Y5_18), .Y6(Y6_18), .Y7(Y534), .Y8(Y535), .Y9(Y536), .Y10(Y537), .Y11(Y538), .Y12(Y539), .Y13(Y540),
    .Y14(Y541), .Y15(Y542), .Y16(Y543), .Y17(Y544), .Y18(Y545), .Y19(Y546), .Y20(Y547), .Y21(Y548),
    .Y22(Y549), .Y23(Y550), .Y24(Y551), .Y25(Y552), .Y26(Y553), .Y27(Y554), .Y28(Y555), .Y29(Y556),
    .Y30(Y557), .Y31(Y558), .Y32(Y559));
  demux32 inst19 (
    .E1(E9), .S5(S5), .S4(S4), .S3(S3), .S2(S2), .S1(S1), .Y1(Y1_19), .Y2(Y2_19), .Y3(Y3_19), .Y4(Y4_19),
    .Y5(Y5_19), .Y6(Y6_19), .Y7(Y565), .Y8(Y566), .Y9(Y567), .Y10(Y568), .Y11(Y569), .Y12(Y570), .Y13(Y571),
    .Y14(Y572), .Y15(Y573), .Y16(Y574), .Y17(Y575), .Y18(Y576), .Y19(Y577), .Y20(Y578), .Y21(Y579),
    .Y22(Y580), .Y23(Y581), .Y24(Y582), .Y25(Y583), .Y26(Y584), .Y27(Y585), .Y28(Y586), .Y29(Y587),
    .Y30(Y588), .Y31(Y589), .Y32(Y590));
  demux32 inst20 (
    .E1(E10), .S5(S5), .S4(S4), .S3(S3), .S2(S2), .S1(S1), .Y1(Y1_20), .Y2(Y2_20), .Y3(Y3_20), .Y4(Y4_20),
    .Y5(Y5_20), .Y6(Y6_20), .Y7(Y596), .Y8(Y597), .Y9(Y598), .Y10(Y599), .Y11(Y600), .Y12(Y601), .Y13(Y602),
    .Y14(Y603), .Y15(Y604), .Y16(Y605), .Y17(Y606), .Y18(Y607), .Y19(Y608), .Y20(Y609), .Y21(Y610),
    .Y22(Y611), .Y23(Y612), .Y24(Y613), .Y25(Y614), .Y26(Y615), .Y27(Y616), .Y28(Y617), .Y29(Y618),
    .Y30(Y619), .Y31(Y620), .Y32(Y621));
  demux32 inst21 (
    .E1(E11), .S5(S5), .S4(S4), .S3(S3), .S2(S2), .S1(S1), .Y1(Y1_21), .Y2(Y2_21), .Y3(Y3_21), .Y4(Y4_21),
    .Y5(Y5_21), .Y6(Y6_21), .Y7(Y627), .Y8(Y628), .Y9(Y629), .Y10(Y630), .Y11(Y631), .Y12(Y632), .Y13(Y633),
    .Y14(Y634), .Y15(Y635), .Y16(Y636), .Y17(Y637), .Y18(Y638), .Y19(Y639), .Y20(Y640), .Y21(Y641),
    .Y22(Y642), .Y23(Y643), .Y24(Y644), .Y25(Y645), .Y26(Y646), .Y27(Y647), .Y28(Y648), .Y29(Y649),
    .Y30(Y650), .Y31(Y651), .Y32(Y652));
  demux32 inst22 (
    .E1(E12), .S5(S5), .S4(S4), .S3(S3), .S2(S2), .S1(S1), .Y1(Y1_22), .Y2(Y2_22), .Y3(Y3_22), .Y4(Y4_22),
    .Y5(Y5_22), .Y6(Y6_22), .Y7(Y658), .Y8(Y659), .Y9(Y660), .Y10(Y661), .Y11(Y662), .Y12(Y663), .Y13(Y664),
    .Y14(Y665), .Y15(Y666), .Y16(Y667), .Y17(Y668), .Y18(Y669), .Y19(Y670), .Y20(Y671), .Y21(Y672),
    .Y22(Y673), .Y23(Y674), .Y24(Y675), .Y25(Y676), .Y26(Y677), .Y27(Y678), .Y28(Y679), .Y29(Y680),
    .Y30(Y681), .Y31(Y682), .Y32(Y683));
  demux32 inst23 (
    .E1(E13), .S5(S5), .S4(S4), .S3(S3), .S2(S2), .S1(S1), .Y1(Y1_23), .Y2(Y2_23), .Y3(Y3_23), .Y4(Y4_23),
    .Y5(Y5_23), .Y6(Y6_23), .Y7(Y689), .Y8(Y690), .Y9(Y691), .Y10(Y692), .Y11(Y693), .Y12(Y694), .Y13(Y695),
    .Y14(Y696), .Y15(Y697), .Y16(Y698), .Y17(Y699), .Y18(Y700), .Y19(Y701), .Y20(Y702), .Y21(Y703),
    .Y22(Y704), .Y23(Y705), .Y24(Y706), .Y25(Y707), .Y26(Y708), .Y27(Y709), .Y28(Y710), .Y29(Y711),
    .Y30(Y712), .Y31(Y713), .Y32(Y714));
  demux32 inst24 (
    .E1(E14), .S5(S5), .S4(S4), .S3(S3), .S2(S2), .S1(S1), .Y1(Y1_24), .Y2(Y2_24), .Y3(Y3_24), .Y4(Y4_24),
    .Y5(Y5_24), .Y6(Y6_24), .Y7(Y720), .Y8(Y721), .Y9(Y722), .Y10(Y723), .Y11(Y724), .Y12(Y725), .Y13(Y726),
    .Y14(Y727), .Y15(Y728), .Y16(Y729), .Y17(Y730), .Y18(Y731), .Y19(Y732), .Y20(Y733), .Y21(Y734),
    .Y22(Y735), .Y23(Y736), .Y24(Y737), .Y25(Y738), .Y26(Y739), .Y27(Y740), .Y28(Y741), .Y29(Y742),
    .Y30(Y743), .Y31(Y744), .Y32(Y745));
  demux32 inst25 (
    .E1(E15), .S5(S5), .S4(S4), .S3(S3), .S2(S2), .S1(S1), .Y1(Y1_25), .Y2(Y2_25), .Y3(Y3_25), .Y4(Y4_25),
    .Y5(Y5_25), .Y6(Y6_25), .Y7(Y751), .Y8(Y752), .Y9(Y753), .Y10(Y754), .Y11(Y755), .Y12(Y756), .Y13(Y757),
    .Y14(Y758), .Y15(Y759), .Y16(Y760), .Y17(Y761), .Y18(Y762), .Y19(Y763), .Y20(Y764), .Y21(Y765),
    .Y22(Y766), .Y23(Y767), .Y24(Y768), .Y25(Y769), .Y26(Y770), .Y27(Y771), .Y28(Y772), .Y29(Y773),
    .Y30(Y774), .Y31(Y775), .Y32(Y776));
  demux32 inst26 (
    .E1(E16), .S5(S5), .S4(S4), .S3(S3), .S2(S2), .S1(S1), .Y1(Y1_26), .Y2(Y2_26), .Y3(Y3_26), .Y4(Y4_26),
    .Y5(Y5_26), .Y6(Y6_26), .Y7(Y782), .Y8(Y783), .Y9(Y784), .Y10(Y785), .Y11(Y786), .Y12(Y787), .Y13(Y788),
    .Y14(Y789), .Y15(Y790), .Y16(Y791), .Y17(Y792), .Y18(Y793), .Y19(Y794), .Y20(Y795), .Y21(Y796),
    .Y22(Y797), .Y23(Y798), .Y24(Y799), .Y25(Y800), .Y26(Y801), .Y27(Y802), .Y28(Y803), .Y29(Y804),
    .Y30(Y805), .Y31(Y806), .Y32(Y807));
  demux32 inst27 (
    .E1(E17), .S5(S5), .S4(S4), .S3(S3), .S2(S2), .S1(S1), .Y1(Y1_27), .Y2(Y2_27), .Y3(Y3_27), .Y4(Y4_27),
    .Y5(Y5_27), .Y6(Y6_27), .Y7(Y813), .Y8(Y814), .Y9(Y815), .Y10(Y816), .Y11(Y817), .Y12(Y818), .Y13(Y819),
    .Y14(Y820), .Y15(Y821), .Y16(Y822), .Y17(Y823), .Y18(Y824), .Y19(Y825), .Y20(Y826), .Y21(Y827),
    .Y22(Y828), .Y23(Y829), .Y24(Y830), .Y25(Y831), .Y26(Y832), .Y27(Y833), .Y28(Y834), .Y29(Y835),
    .Y30(Y836), .Y31(Y837), .Y32(Y838));
  demux32 inst28 (
    .E1(E18), .S5(S5), .S4(S4), .S3(S3), .S2(S2), .S1(S1), .Y1(Y1_28), .Y2(Y2_28), .Y3(Y3_28), .Y4(Y4_28),
    .Y5(Y5_28), .Y6(Y6_28), .Y7(Y844), .Y8(Y845), .Y9(Y846), .Y10(Y847), .Y11(Y848), .Y12(Y849), .Y13(Y850),
    .Y14(Y851), .Y15(Y852), .Y16(Y853), .Y17(Y854), .Y18(Y855), .Y19(Y856), .Y20(Y857), .Y21(Y858),
    .Y22(Y859), .Y23(Y860), .Y24(Y861), .Y25(Y862), .Y26(Y863), .Y27(Y864), .Y28(Y865), .Y29(Y866),
    .Y30(Y867), .Y31(Y868), .Y32(Y869));
  demux32 inst29 (
    .E1(E19), .S5(S5), .S4(S4), .S3(S3), .S2(S2), .S1(S1), .Y1(Y1_29), .Y2(Y2_29), .Y3(Y3_29), .Y4(Y4_29),
    .Y5(Y5_29), .Y6(Y6_29), .Y7(Y875), .Y8(Y876), .Y9(Y877), .Y10(Y878), .Y11(Y879), .Y12(Y880), .Y13(Y881),
    .Y14(Y882), .Y15(Y883), .Y16(Y884), .Y17(Y885), .Y18(Y886), .Y19(Y887), .Y20(Y888), .Y21(Y889),
    .Y22(Y890), .Y23(Y891), .Y24(Y892), .Y25(Y893), .Y26(Y894), .Y27(Y895), .Y28(Y896), .Y29(Y897),
    .Y30(Y898), .Y31(Y899), .Y32(Y900));
  demux32 inst30 (
    .E1(E20), .S5(S5), .S4(S4), .S3(S3), .S2(S2), .S1(S1), .Y1(Y1_30), .Y2(Y2_30), .Y3(Y3_30), .Y4(Y4_30),
    .Y5(Y5_30), .Y6(Y6_30), .Y7(Y906), .Y8(Y907), .Y9(Y908), .Y10(Y909), .Y11(Y910), .Y12(Y911), .Y13(Y912),
    .Y14(Y913), .Y15(Y914), .Y16(Y915), .Y17(Y916), .Y18(Y917), .Y19(Y918), .Y20(Y919), .Y21(Y920),
    .Y22(Y921), .Y23(Y922), .Y24(Y923), .Y25(Y924), .Y26(Y925), .Y27(Y926), .Y28(Y927), .Y29(Y928),
    .Y30(Y929), .Y31(Y930), .Y32(Y931));
  demux32 inst31 (
    .E1(E21), .S5(S5), .S4(S4), .S3(S3), .S2(S2), .S1(S1), .Y1(Y1_31), .Y2(Y2_31), .Y3(Y3_31), .Y4(Y4_31),
    .Y5(Y5_31), .Y6(Y6_31), .Y7(Y937), .Y8(Y938), .Y9(Y939), .Y10(Y940), .Y11(Y941), .Y12(Y942), .Y13(Y943),
    .Y14(Y944), .Y15(Y945), .Y16(Y946), .Y17(Y947), .Y18(Y948), .Y19(Y949), .Y20(Y950), .Y21(Y951),
    .Y22(Y952), .Y23(Y953), .Y24(Y954), .Y25(Y955), .Y26(Y956), .Y27(Y957), .Y28(Y958), .Y29(Y959),
    .Y30(Y960), .Y31(Y961), .Y32(Y962));
  demux32 inst32 (
    .E1(E22), .S5(S5), .S4(S4), .S3(S3), .S2(S2), .S1(S1), .Y1(Y1_32), .Y2(Y2_32), .Y3(Y3_32), .Y4(Y4_32),
    .Y5(Y5_32), .Y6(Y6_32), .Y7(Y968), .Y8(Y969), .Y9(Y970), .Y10(Y971), .Y11(Y972), .Y12(Y973), .Y13(Y974),
    .Y14(Y975), .Y15(Y976), .Y16(Y977), .Y17(Y978), .Y18(Y979), .Y19(Y980), .Y20(Y981), .Y21(Y982),
    .Y22(Y983), .Y23(Y984), .Y24(Y985), .Y25(Y986), .Y26(Y987), .Y27(Y988), .Y28(Y989), .Y29(Y990),
    .Y30(Y991), .Y31(Y992), .Y32(Y993));
endmodule
